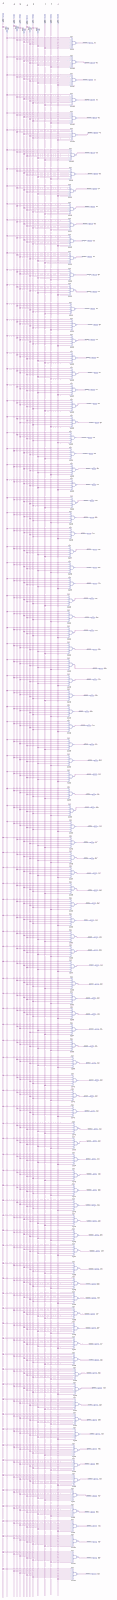
[diagram p0: schematic sheet, whole]
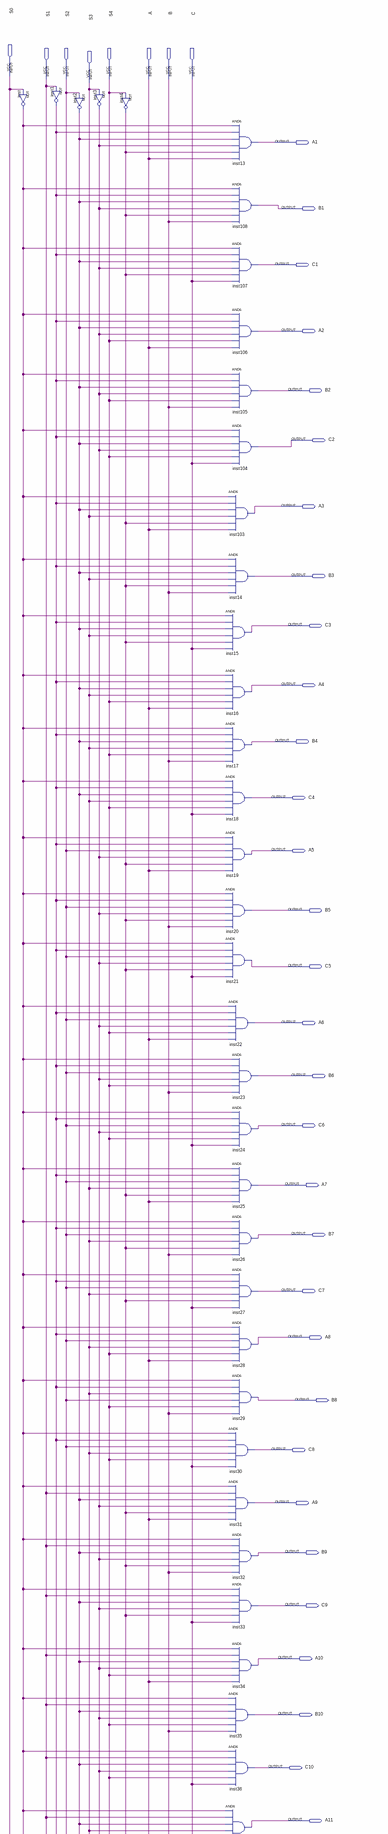
[diagram p1: schematic sheet, upper part]
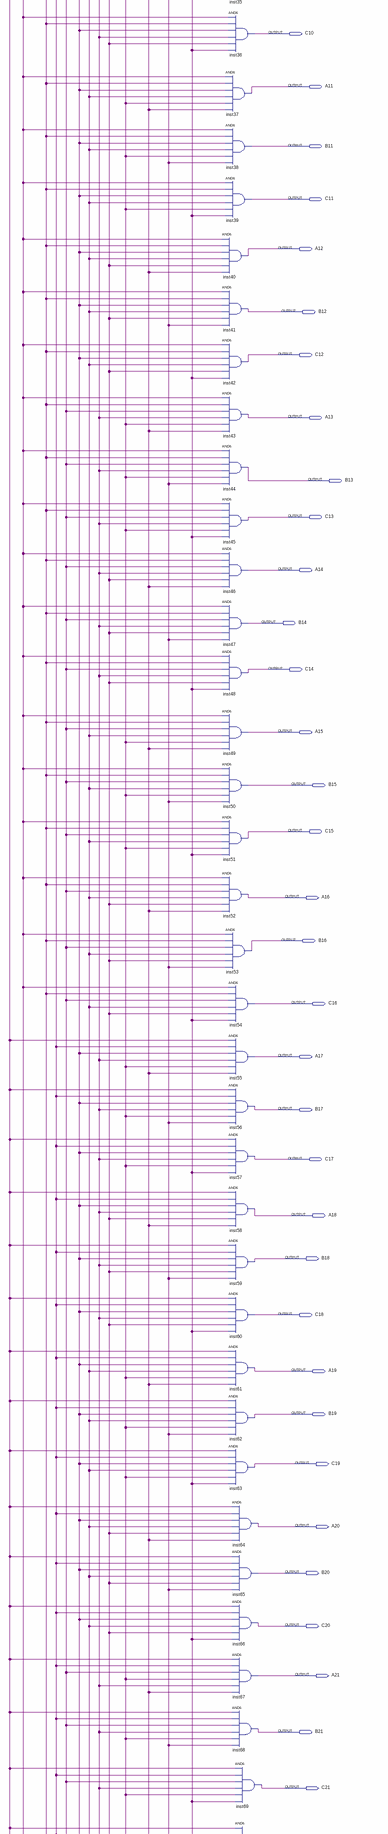
[diagram p2: schematic sheet, middle part]
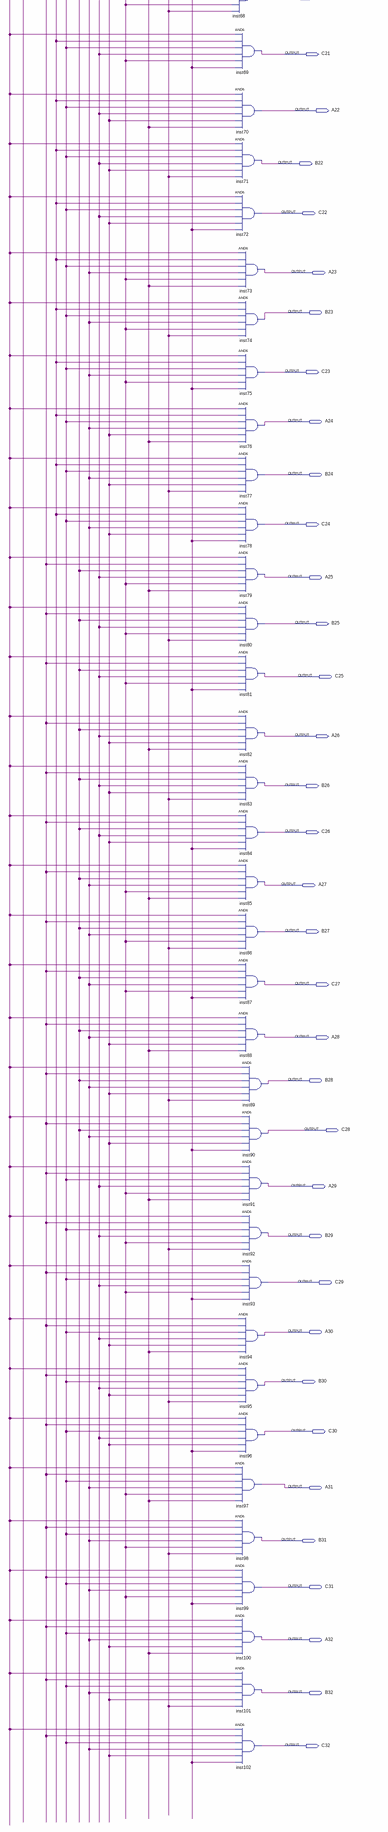
[diagram p3: schematic sheet, lower part]
// Quartus schematic Demux32x1.bdf as structural Verilog: 101 symbols, 104 pins
module Demux32x1 (
  input  S0,
  input  S1,
  input  S2,
  input  S4,
  input  A,
  input  B,
  input  C,
  input  S3,
  output A1,
  output B1,
  output C1,
  output A2,
  output B2,
  output C2,
  output A3,
  output B3,
  output C3,
  output A4,
  output B4,
  output C4,
  output A5,
  output B5,
  output C5,
  output A6,
  output B6,
  output C6,
  output A7,
  output B7,
  output C7,
  output A8,
  output B8,
  output C8,
  output A9,
  output B9,
  output C9,
  output A10,
  output B10,
  output C10,
  output A11,
  output B11,
  output C11,
  output A12,
  output B12,
  output C12,
  output A13,
  output B13,
  output C13,
  output A14,
  output B14,
  output C14,
  output A15,
  output B15,
  output C15,
  output A16,
  output B16,
  output C16,
  output A17,
  output B17,
  output C17,
  output A18,
  output B18,
  output C18,
  output A19,
  output B19,
  output C19,
  output A20,
  output B20,
  output C20,
  output A21,
  output B21,
  output C21,
  output A22,
  output B22,
  output C22,
  output A23,
  output B23,
  output C23,
  output A24,
  output B24,
  output C24,
  output A25,
  output B25,
  output C25,
  output A26,
  output B26,
  output C26,
  output A27,
  output B27,
  output C27,
  output A28,
  output B28,
  output C28,
  output A29,
  output B29,
  output C29,
  output A30,
  output B30,
  output C30,
  output A31,
  output B31,
  output C31,
  output A32,
  output B32,
  output C32
);

  wire inst1_out, inst2_out, inst3_out, inst4_out, inst_out;

  not inst (inst_out, S0);
  not inst1 (inst1_out, S1);
  not inst2 (inst2_out, S2);
  not inst3 (inst3_out, S3);
  not inst4 (inst4_out, S4);
  and inst13 (A1, inst_out, inst1_out, inst2_out, inst3_out, inst4_out, A);
  and inst108 (B1, inst_out, inst1_out, inst2_out, inst3_out, inst4_out, B);
  and inst107 (C1, inst_out, inst1_out, inst2_out, inst3_out, inst4_out, C);
  and inst106 (A2, inst_out, inst1_out, inst2_out, inst3_out, S4, A);
  and inst105 (B2, inst_out, inst1_out, inst2_out, inst3_out, S4, B);
  and inst104 (C2, inst_out, inst1_out, inst2_out, inst3_out, S4, C);
  and inst103 (A3, inst_out, inst1_out, inst2_out, S3, inst4_out, A);
  and inst14 (B3, inst_out, inst1_out, inst2_out, S3, inst4_out, B);
  and inst15 (C3, inst_out, inst1_out, inst2_out, S3, inst4_out, C);
  and inst16 (A4, inst_out, inst1_out, inst2_out, S3, S4, A);
  and inst17 (B4, inst_out, inst1_out, inst2_out, S3, S4, B);
  and inst18 (C4, inst_out, inst1_out, inst2_out, S3, S4, C);
  and inst19 (A5, inst_out, inst1_out, S2, inst3_out, inst4_out, A);
  and inst20 (B5, inst_out, inst1_out, S2, inst3_out, inst4_out, B);
  and inst21 (C5, inst_out, inst1_out, S2, inst3_out, inst4_out, C);
  and inst22 (A6, inst_out, inst1_out, S2, inst3_out, S4, A);
  and inst23 (B6, inst_out, inst1_out, S2, inst3_out, S4, B);
  and inst24 (C6, inst_out, inst1_out, S2, inst3_out, S4, C);
  and inst25 (A7, inst_out, inst1_out, S2, S3, inst4_out, A);
  and inst26 (B7, inst_out, inst1_out, S2, S3, inst4_out, B);
  and inst27 (C7, inst_out, inst1_out, S2, S3, inst4_out, C);
  and inst28 (A8, inst_out, inst1_out, S2, S3, S4, A);
  and inst29 (B8, inst_out, inst1_out, S3, S2, S4, B);
  and inst30 (C8, inst_out, inst1_out, S2, S3, S4, C);
  and inst31 (A9, inst_out, S1, inst2_out, inst3_out, inst4_out, A);
  and inst32 (B9, inst_out, S1, inst2_out, inst3_out, inst4_out, B);
  and inst33 (C9, inst_out, S1, inst2_out, inst3_out, inst4_out, C);
  and inst34 (A10, inst_out, S1, inst2_out, inst3_out, S4, A);
  and inst35 (B10, inst_out, S1, inst2_out, inst3_out, S4, B);
  and inst36 (C10, inst_out, S1, inst2_out, inst3_out, S4, C);
  and inst37 (A11, inst_out, S1, inst2_out, S3, inst4_out, A);
  and inst38 (B11, inst_out, S1, inst2_out, S3, inst4_out, B);
  and inst39 (C11, inst_out, S1, inst2_out, S3, inst4_out, C);
  and inst40 (A12, inst_out, S1, inst2_out, S3, S4, A);
  and inst41 (B12, inst_out, S1, inst2_out, S3, S4, B);
  and inst42 (C12, inst_out, S1, inst2_out, S3, S4, C);
  and inst43 (A13, inst_out, S1, S2, inst3_out, inst4_out, A);
  and inst44 (B13, inst_out, S1, S2, inst3_out, inst4_out, B);
  and inst45 (C13, inst_out, S1, S2, inst3_out, inst4_out, C);
  and inst46 (A14, inst_out, S1, S2, inst3_out, S4, A);
  and inst47 (B14, inst_out, S1, S2, inst3_out, S4, B);
  and inst48 (C14, inst_out, S1, S2, inst3_out, S4, C);
  and inst49 (A15, inst_out, S1, S2, S3, inst4_out, A);
  and inst50 (B15, inst_out, S1, S2, S3, inst4_out, B);
  and inst51 (C15, inst_out, S1, S2, S3, inst4_out, C);
  and inst52 (A16, inst_out, S1, S2, S3, S4, A);
  and inst53 (B16, inst_out, S1, S2, S3, S4, B);
  and inst54 (C16, inst_out, S1, S2, S3, S4, C);
  and inst55 (A17, S0, inst1_out, inst2_out, inst3_out, inst4_out, A);
  and inst56 (B17, S0, inst1_out, inst2_out, inst3_out, inst4_out, B);
  and inst57 (C17, S0, inst1_out, inst2_out, inst3_out, inst4_out, C);
  and inst58 (A18, S0, inst1_out, inst2_out, inst3_out, S4, A);
  and inst59 (B18, S0, inst1_out, inst2_out, inst3_out, S4, B);
  and inst60 (C18, S0, inst1_out, inst2_out, inst3_out, S4, C);
  and inst61 (A19, S0, inst1_out, inst2_out, S3, inst4_out, A);
  and inst62 (B19, S0, inst1_out, inst2_out, S3, inst4_out, B);
  and inst63 (C19, S0, inst1_out, inst2_out, S3, inst4_out, C);
  and inst64 (A20, S0, inst1_out, inst2_out, S3, S4, A);
  and inst65 (B20, S0, inst1_out, inst2_out, S3, S4, B);
  and inst66 (C20, S0, inst1_out, inst2_out, S3, S4, C);
  and inst67 (A21, S0, inst1_out, S2, inst4_out, inst3_out, A);
  and inst68 (B21, S0, inst1_out, S2, inst3_out, inst4_out, B);
  and inst69 (C21, S0, inst1_out, S2, inst3_out, inst4_out, C);
  and inst70 (A22, S0, inst1_out, S2, inst3_out, S4, A);
  and inst71 (B22, S0, inst1_out, S2, inst3_out, S4, B);
  and inst72 (C22, S0, inst1_out, S2, inst3_out, S4, C);
  and inst73 (A23, S0, inst1_out, S2, S3, inst4_out, A);
  and inst74 (B23, S0, inst1_out, S2, S3, inst4_out, B);
  and inst75 (C23, S0, inst1_out, S2, S3, inst4_out, C);
  and inst76 (A24, S0, inst1_out, S2, S3, S4, A);
  and inst77 (B24, S0, inst1_out, S2, S3, S4, B);
  and inst78 (C24, S0, inst1_out, S2, S3, S4, C);
  and inst79 (A25, S0, S1, inst2_out, inst3_out, inst4_out, A);
  and inst80 (B25, S0, S1, inst2_out, inst3_out, inst4_out, B);
  and inst81 (C25, S0, S1, inst2_out, inst3_out, inst4_out, C);
  and inst82 (A26, S0, S1, inst2_out, inst3_out, S4, A);
  and inst83 (B26, S0, S1, inst2_out, inst3_out, S4, B);
  and inst84 (C26, S0, S1, inst2_out, inst3_out, S4, C);
  and inst85 (A27, S0, S1, inst2_out, S3, inst4_out, A);
  and inst86 (B27, S0, S1, inst2_out, S3, inst4_out, B);
  and inst87 (C27, S0, S1, inst2_out, S3, inst4_out, C);
  and inst88 (A28, S0, S1, inst2_out, S3, S4, A);
  and inst89 (B28, S0, S1, inst2_out, S3, S4, B);
  and inst90 (C28, S0, S1, inst2_out, S3, S4, C);
  and inst91 (A29, S0, S1, S2, inst3_out, inst4_out, A);
  and inst92 (B29, S0, S1, S2, inst3_out, inst4_out, B);
  and inst93 (C29, S0, S1, S2, inst3_out, inst4_out, C);
  and inst94 (A30, S0, S1, S2, inst3_out, S4, A);
  and inst95 (B30, S0, S1, S2, inst3_out, S4, B);
  and inst96 (C30, S0, S1, S2, inst3_out, S4, C);
  and inst97 (A31, S0, S1, S2, S3, inst4_out, A);
  and inst98 (B31, S0, S1, S2, S3, inst4_out, B);
  and inst99 (C31, S0, S1, S2, S3, inst4_out, C);
  and inst100 (A32, S0, S1, S2, S3, S4, A);
  and inst101 (B32, S0, S1, S2, S3, S4, B);
  and inst102 (C32, S0, S1, S2, S3, S4, C);
endmodule
